# EAGLE design waterRunner (EAGLE 6.4)
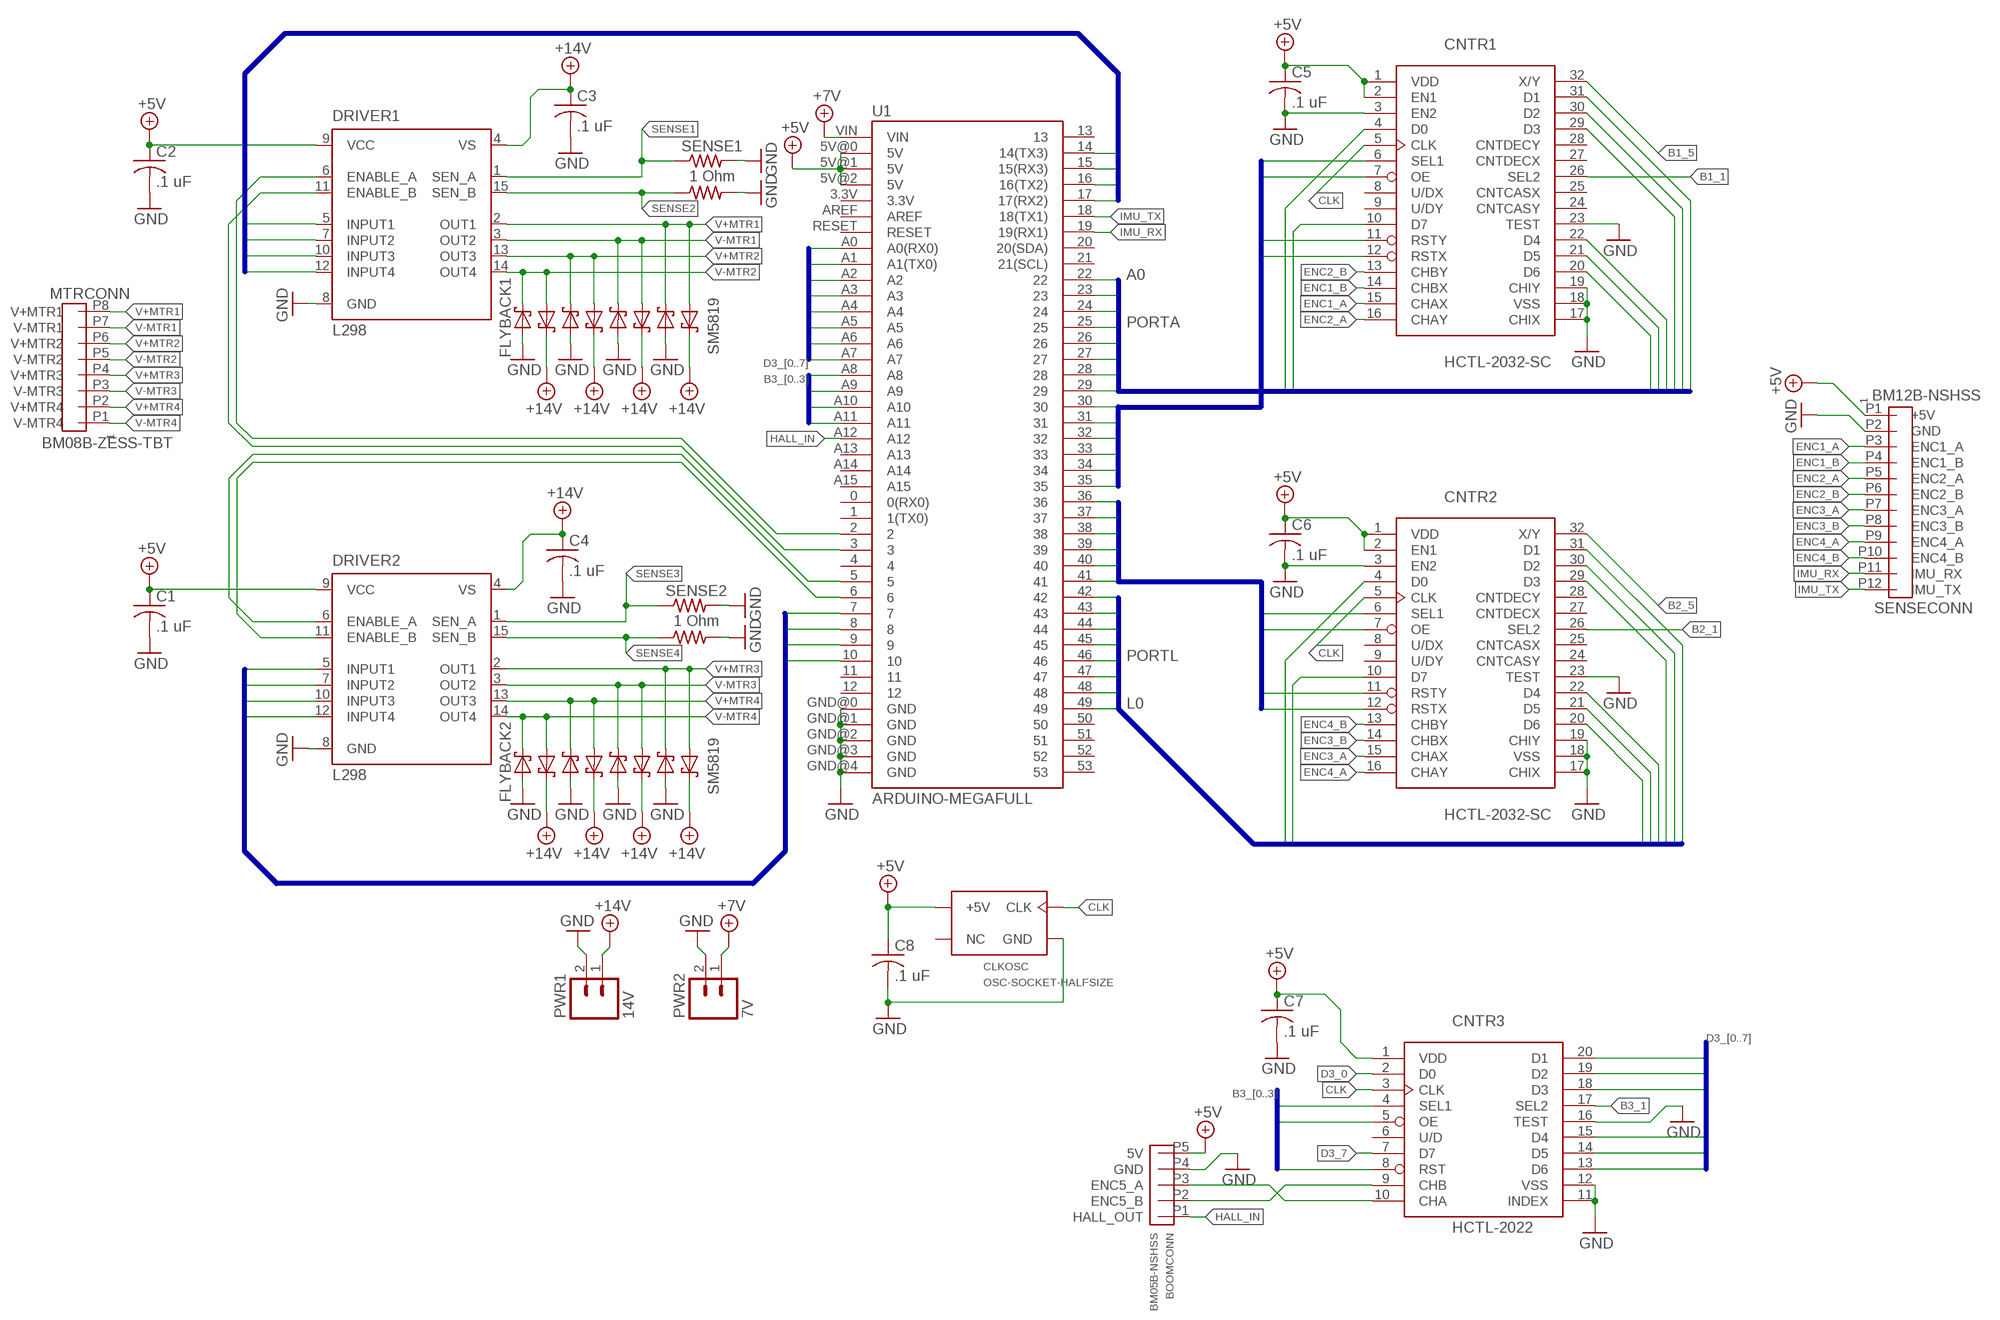
[diagram p0: schematic, sheet 1]

## Parts
BOOMCONN  BM05B-NSHSS  [BM05B-NSHSS]
C1  .1 uF  C-USC1608  [C1608]
C2  .1 uF  C-USC1608  [C1608]
C3  .1 uF  C-USC1608  [C1608]
C4  .1 uF  C-USC1608  [C1608]
C5  .1 uF  C-USC1608  [C1608]
C6  .1 uF  C-USC1608  [C1608]
C7  .1 uF  C-USC1608  [C1608]
C8  .1 uF  C-USC1608  [C1608]
CLKOSC  OSC-SOCKET-HALFSIZE  [OSC-SOCKET-HALFSIZE]
CNTR1  HCTL-2032-SC  [SO32W]
CNTR2  HCTL-2032-SC  [SO32W]
CNTR3  HCTL-2022  [DIL20]
DRIVER1  L298  [MULTIWATT-15]
DRIVER2  L298  [MULTIWATT-15]
FLYBACK1  SM5819  SM5817  [SOD123FL]
FLYBACK2  SM5819  SM5817  [SOD123FL]
MTRCONN  BM08B-ZESS-TBT  [BM08B-ZESS-TBT]
PWR1  14V  M025MM  [SCREWTERMINAL-5MM-2]
PWR2  7V  M025MM  [SCREWTERMINAL-5MM-2]
R1  1 Ohm  RL1220  [RL1220]
R2  1 Ohm  RL1220  [RL1220]
SENSE1  1 Ohm  RL1220  [RL1220]
SENSE2  1 Ohm  RL1220  [RL1220]
SENSECONN  BM12B-NSHSS  [BM12B-NSHSS]
U1  ARDUINO-MEGAFULL  [ARDUINO_MEGA]
U$1  SM5817  [SOD123FL]
U$2  SM5817  [SOD123FL]
U$3  SM5819  SM5817  [SOD123FL]
U$4  SM5817  [SOD123FL]
U$5  SM5817  [SOD123FL]
U$6  SM5817  [SOD123FL]
U$7  SM5817  [SOD123FL]
U$8  SM5819  SM5817  [SOD123FL]
U$9  SM5817  [SOD123FL]
U$10  SM5817  [SOD123FL]
U$11  SM5817  [SOD123FL]
U$12  SM5817  [SOD123FL]
U$13  SM5817  [SOD123FL]
U$14  SM5819  SM5817  [SOD123FL]

## Nets
+5V: BOOMCONN.P5(5V) C1.1 C2.1 C5.1 C6.1 C7.1 C8.1 CLKOSC.P8(+5V) CNTR1.1(VDD) CNTR1.2(EN1) CNTR2.1(VDD) CNTR2.2(EN1) CNTR3.1(VDD) DRIVER1.9(VCC) DRIVER2.9(VCC) SENSECONN.P1(+5V) U1.5V@0(5V) U1.5V@1(5V) U1.5V@2(5V)
+7V: PWR2.1 U1.VIN
+14V [PWR]: C3.1 C4.1 DRIVER1.4(VS) DRIVER2.4(VS) PWR1.1 U$1.C U$2.C U$4.C U$6.C U$8.C U$10.C U$12.C U$14.C
B1_0: CNTR1.6(SEL1) U1.30
B1_1: CNTR1.26(SEL2) U1.31
B1_2: CNTR1.7(OE) U1.32
B1_3: CNTR1.11(RSTY) U1.33
B1_4: CNTR1.12(RSTX) U1.34
B1_5: CNTR1.32(X/Y) U1.35
B2_0: CNTR2.6(SEL1) U1.36
B2_1: CNTR2.26(SEL2) U1.37
B2_2: CNTR2.7(OE) U1.38
B2_3: CNTR2.11(RSTY) U1.39
B2_4: CNTR2.12(RSTX) U1.40
B2_5: CNTR2.32(X/Y) U1.41
B3_0: CNTR3.4(SEL1) U1.A8
B3_1: CNTR3.17(SEL2) U1.A9
B3_2: CNTR3.5(OE) U1.A10
B3_3: CNTR3.8(RST) U1.A11
CLK: CLKOSC.P5(CLK) CNTR1.5(CLK) CNTR2.5(CLK) CNTR3.3(CLK)
D1_0: CNTR1.4(D0) U1.22
D1_1: CNTR1.31(D1) U1.23
D1_2: CNTR1.30(D2) U1.24
D1_3: CNTR1.29(D3) U1.25
D1_4: CNTR1.22(D4) U1.26
D1_5: CNTR1.21(D5) U1.27
D1_6: CNTR1.20(D6) U1.28
D1_7: CNTR1.10(D7) U1.29
D2_0: CNTR2.4(D0) U1.49
D2_1: CNTR2.31(D1) U1.48
D2_2: CNTR2.30(D2) U1.47
D2_3: CNTR2.29(D3) U1.46
D2_4: CNTR2.22(D4) U1.45
D2_5: CNTR2.21(D5) U1.44
D2_6: CNTR2.20(D6) U1.43
D2_7: CNTR2.10(D7) U1.42
D3_0: CNTR3.2(D0) U1.A0(A0(RX0))
D3_1: CNTR3.20(D1) U1.A1(A1(TX0))
D3_2: CNTR3.19(D2) U1.A2
D3_3: CNTR3.18(D3) U1.A3
D3_4: CNTR3.15(D4) U1.A4
D3_5: CNTR3.14(D5) U1.A5
D3_6: CNTR3.13(D6) U1.A6
D3_7: CNTR3.7(D7) U1.A7
ENC1_A: CNTR1.15(CHAX) SENSECONN.P3(ENC1_A)
ENC1_B: CNTR1.14(CHBX) SENSECONN.P4(ENC1_B)
ENC2_A: CNTR1.16(CHAY) SENSECONN.P5(ENC2_A)
ENC2_B: CNTR1.13(CHBY) SENSECONN.P6(ENC2_B)
ENC3_A: CNTR2.15(CHAX) SENSECONN.P7(ENC3_A)
ENC3_B: CNTR2.14(CHBX) SENSECONN.P8(ENC3_B)
ENC4_A: CNTR2.16(CHAY) SENSECONN.P9(ENC4_A)
ENC4_B: CNTR2.13(CHBY) SENSECONN.P10(ENC4_B)
ENC5_A: BOOMCONN.P3(ENC5_A) CNTR3.10(CHA)
ENC5_B: BOOMCONN.P2(ENC5_B) CNTR3.9(CHB)
GND: BOOMCONN.P4(GND) C1.2 C2.2 C3.2 C4.2 C5.2 C6.2 C7.2 C8.2 CLKOSC.P4(GND) CNTR1.3(EN2) CNTR1.17(CHIX) CNTR1.18(VSS) CNTR1.19(CHIY) CNTR1.23(TEST) CNTR2.3(EN2) CNTR2.17(CHIX) CNTR2.18(VSS) CNTR2.19(CHIY) CNTR2.23(TEST) CNTR3.11(INDEX) CNTR3.12(VSS) CNTR3.16(TEST) DRIVER1.8(GND) DRIVER2.8(GND) FLYBACK1.A FLYBACK2.A PWR1.2 PWR2.2 R1.P$2 R2.P$2 SENSE1.P$2 SENSE2.P$2 SENSECONN.P2(GND) U1.GND@0(GND) U1.GND@1(GND) U1.GND@2(GND) U1.GND@3(GND) U1.GND@4(GND) U$3.A U$5.A U$7.A U$9.A U$11.A U$13.A
HALL_IN: BOOMCONN.P1(HALL_OUT) U1.A12
IMU_RX: SENSECONN.P11(IMU_RX) U1.19(19(RX1))
IMU_TX: SENSECONN.P12(IMU_TX) U1.18(18(TX1))
IN1_1: DRIVER1.5(INPUT1) U1.14(14(TX3))
IN1_2: DRIVER1.7(INPUT2) U1.15(15(RX3))
IN1_3: DRIVER1.10(INPUT3) U1.16(16(TX2))
IN1_4: DRIVER1.12(INPUT4) U1.17(17(RX2))
IN2_1: DRIVER2.5(INPUT1) U1.7
IN2_2: DRIVER2.7(INPUT2) U1.8
IN2_3: DRIVER2.10(INPUT3) U1.9
IN2_4: DRIVER2.12(INPUT4) U1.10
PWM1: DRIVER1.6(ENABLE_A) U1.2
PWM2: DRIVER1.11(ENABLE_B) U1.3
PWM3: DRIVER2.6(ENABLE_A) U1.5
PWM4: DRIVER2.11(ENABLE_B) U1.6
SENSE1: DRIVER1.1(SEN_A) SENSE1.P$1
SENSE2: DRIVER1.15(SEN_B) R2.P$1
SENSE3: DRIVER2.1(SEN_A) SENSE2.P$1
SENSE4: DRIVER2.15(SEN_B) R1.P$1
V+MTR1 [PWR]: DRIVER1.2(OUT1) MTRCONN.P8(V+MTR1) U$13.C U$14.A
V+MTR2 [PWR]: DRIVER1.13(OUT3) MTRCONN.P6(V+MTR2) U$9.C U$10.A
V+MTR3 [PWR]: DRIVER2.2(OUT1) MTRCONN.P4(V+MTR3) U$7.C U$8.A
V+MTR4 [PWR]: DRIVER2.13(OUT3) MTRCONN.P2(V+MTR4) U$3.C U$4.A
V-MTR1 [PWR]: DRIVER1.3(OUT2) MTRCONN.P7(V-MTR1) U$11.C U$12.A
V-MTR2 [PWR]: DRIVER1.14(OUT4) FLYBACK1.C MTRCONN.P5(V-MTR2) U$1.A
V-MTR3 [PWR]: DRIVER2.3(OUT2) MTRCONN.P3(V-MTR3) U$5.C U$6.A
V-MTR4 [PWR]: DRIVER2.14(OUT4) FLYBACK2.C MTRCONN.P1(V-MTR4) U$2.A
Unconnected: CLKOSC.P1(NC) CNTR1.8(U/DX) CNTR1.9(U/DY) CNTR1.24(CNTCASY) CNTR1.25(CNTCASX) CNTR1.27(CNTDECX) CNTR1.28(CNTDECY) CNTR2.8(U/DX) CNTR2.9(U/DY) CNTR2.24(CNTCASY) CNTR2.25(CNTCASX) CNTR2.27(CNTDECX) CNTR2.28(CNTDECY) CNTR3.6(U/D) U1.0(0(RX0)) U1.1(1(TX0)) U1.3.3V U1.4 U1.11 U1.12 U1.13 U1.20(20(SDA)) U1.21(21(SCL)) U1.50 U1.51 U1.52 U1.53 U1.A13 U1.A14 U1.A15 U1.AREF U1.RESET

## Buses
IN1_[1..4]
IN2_[1..4]
D1_[0..7]
B1_[0..5]
D2_[0..7]
B2_[0..5]
D3_[0..7]
B3_[0..3]

## Notes on the sheet
- A0
- PORTA
- PORTL
- L0

## Library data of the parts
BOOMCONN = mylbr:BM05B-NSHSS
C1-C8 = rcl:C-US: CAPACITOR, American symbol
CLKOSC = mylbr:OSC-SOCKET-HALFSIZE
CNTR1 CNTR2 = avago2:HCTL-2032-SC
CNTR3 = avago2:HCTL-2022
DRIVER1 DRIVER2 = st-microelectronics:L298: DUAL FULL-BRIDGE DRIVER; MPN: L298N; OC_FARNELL: 1589425; OC_NEWARK: 32M1527
FLYBACK1 FLYBACK2 U$1-U$14 = diode:SM5817
MTRCONN = mylbr:BM08B-ZESS-TBT
PWR1 PWR2 = SparkFun-Connectors:M02: Header 2 Standard 2-pin 0.1" header. Use with straight break away headers (SKU : PRT-00116), right angle break away headers (PRT-00553), swiss pins (PRT-00743), machine pins (PRT-00117), and female headers (PRT-00115). Molex polarized connector foot print use with SKU : PRT-08233 with associated crimp pins and housings.
R1 R2 SENSE1 SENSE2 = mylbr:RL1220
SENSECONN = mylbr:BM12B-NSHSS
U1 = SparkFun-Boards:ARDUINO-MEGA: Arduino Mega board footprint

## Net classes
0 default: width 0.254 mm, drill 0.508 mm, clearance 0.254 mm
1 PWR: width 0.305 mm, drill 0.508 mm, clearance 0.305 mm

## Board
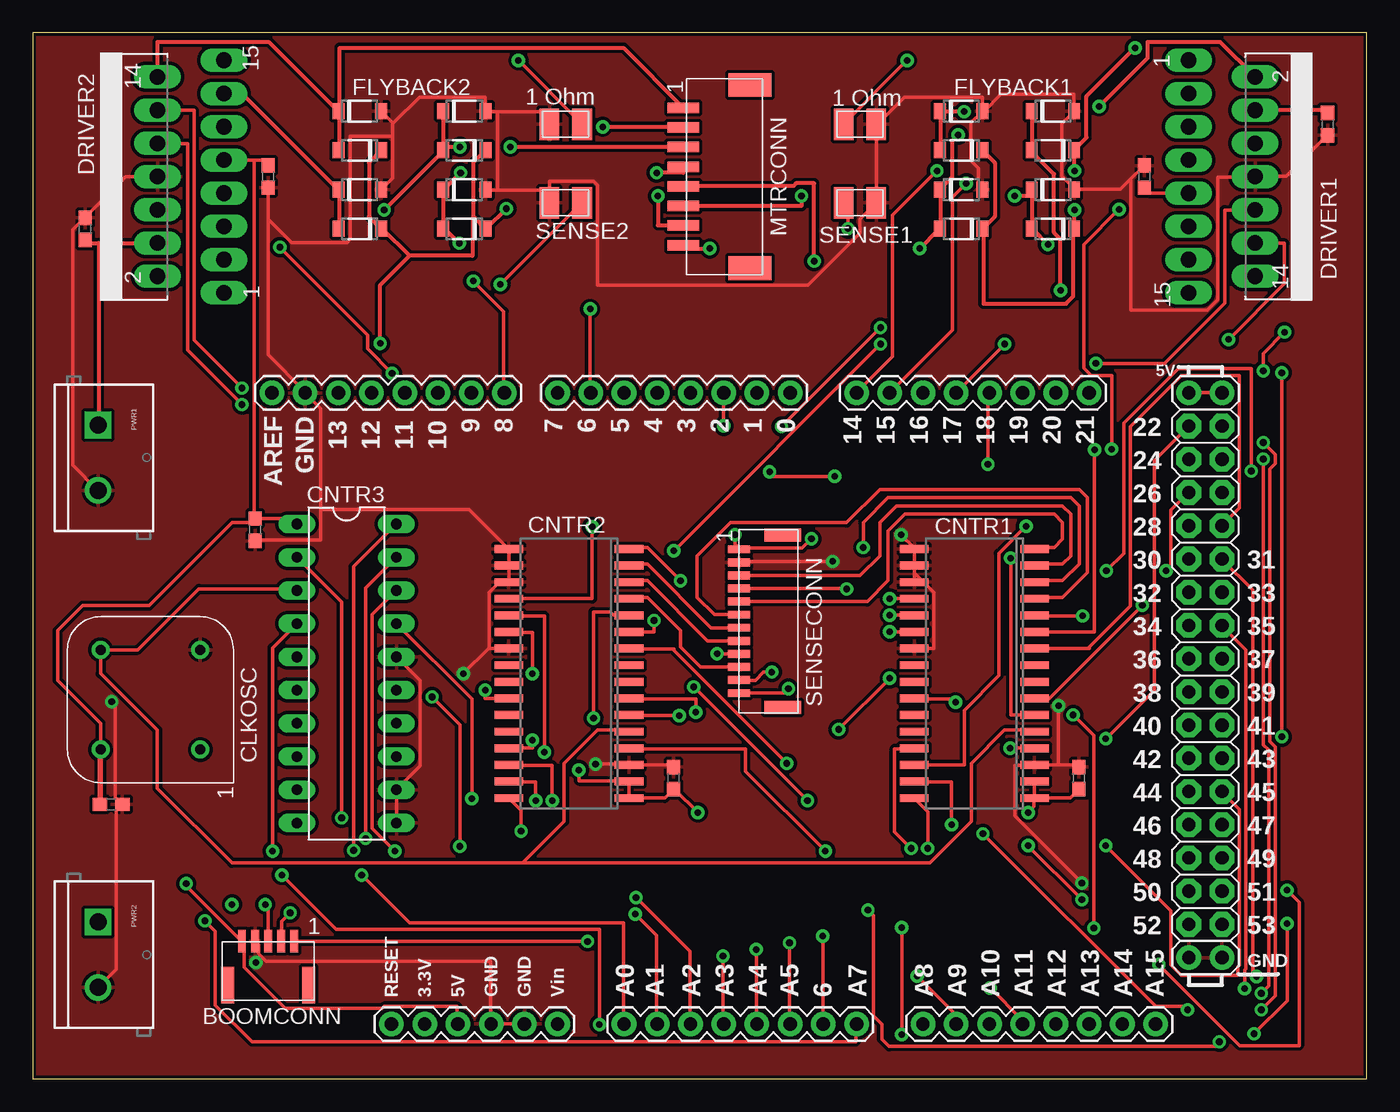
[diagram p1: board, top side]
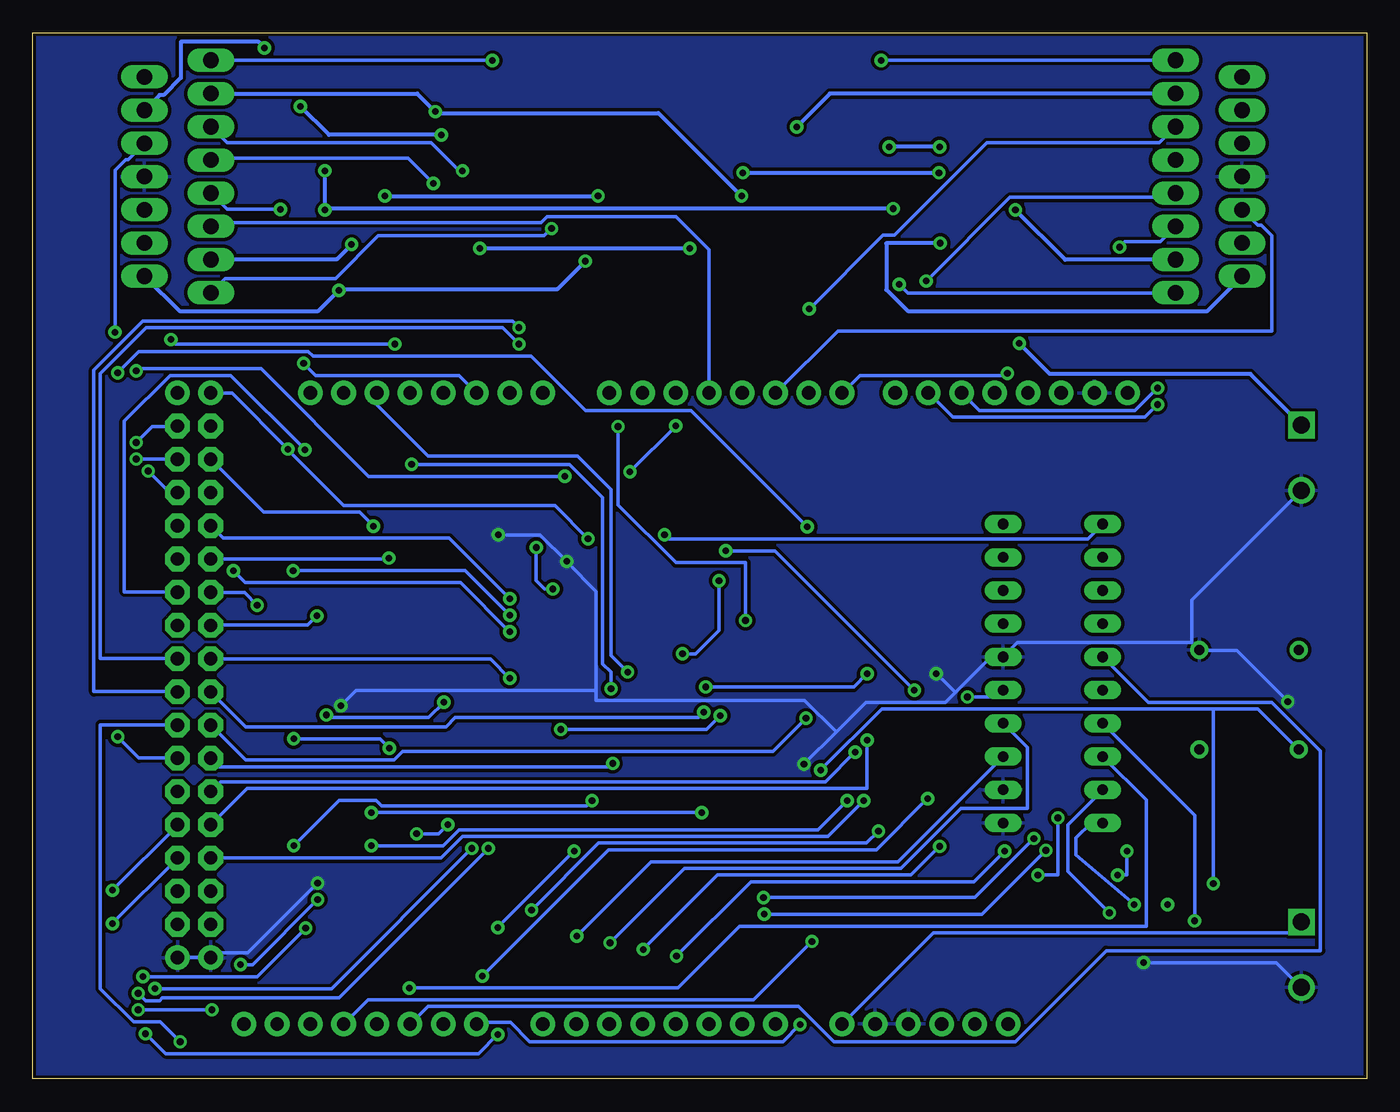
[diagram p2: board, bottom side, seen from below]

Size 102 x 80 mm. Coordinates in mm from the lower left corner, seen from the top.
Outline: 0,0 102,0 102,80 0,80 0,0
Copper layers (1*16): Top 0.035mm / dielectric 1.5mm / Bottom 0.035mm
Design rules "SparkFun": minimum track width 8mil, minimum drill 20mil, track to track 8mil, track to pad 8mil, pad to pad 8mil, via to via 8mil, smd to smd 8mil, copper to edge 10mil, drill to drill 8mil, minimum pad ring 12mil, minimum via ring 10mil, stop-mask expansion 4mil, vias tented up to drill 25mil, thermal gap 10mil

### Footprints (pad centres in the part's own frame; a part is rotated, then mirrored left to right if it is on the bottom)
BM05B-NSHSS = smd 0.6 x 1.7: P1 2,2.54; P2 1,2.54; P3 0,2.54; P4 -1,2.54; P5 -2,2.54 | smd 1 x 2.8: S1 3.1,-0.81; S2 -3.1,-0.81
C1608 = smd 1.1 x 1: 1 -0.85,0; 2 0.85,0
OSC-SOCKET-HALFSIZE = drill 0.762: P1 -3.81,-3.81; P4 3.81,-3.81; P5 3.81,3.81; P8 -3.81,3.81
SO32W = smd 0.6 x 2.2: 1 -9.525,-4.6; 2 -8.255,-4.6; 3 -6.985,-4.6; 4 -5.715,-4.6; 5 -4.445,-4.6; 6 -3.175,-4.6; 7 -1.905,-4.6; 8 -0.635,-4.6; 9 0.635,-4.6; 10 1.905,-4.6; 11 3.175,-4.6; 12 4.445,-4.6; 13 5.715,-4.6; 14 6.985,-4.6; 15 8.255,-4.6; 16 9.525,-4.6; 17 9.525,4.6; 18 8.255,4.6; 19 6.985,4.6; 20 5.715,4.6; 21 4.445,4.6; 22 3.175,4.6; 23 1.905,4.6; 24 0.635,4.6; 25 -0.635,4.6; 26 -1.905,4.6; 27 -3.175,4.6; 28 -4.445,4.6; 29 -5.715,4.6; 30 -6.985,4.6; 31 -8.255,4.6; 32 -9.525,4.6
DIL20 = drill 0.813 long: 1 -11.43,-3.81; 2 -8.89,-3.81; 3 -6.35,-3.81; 4 -3.81,-3.81; 5 -1.27,-3.81; 6 1.27,-3.81; 7 3.81,-3.81; 8 6.35,-3.81; 9 8.89,-3.81; 10 11.43,-3.81; 11 11.43,3.81; 12 8.89,3.81; 13 6.35,3.81; 14 3.81,3.81; 15 1.27,3.81; 16 -1.27,3.81; 17 -3.81,3.81; 18 -6.35,3.81; 19 -8.89,3.81; 20 -11.43,3.81
MULTIWATT-15 = drill 1.2 long: 1 -8.89,-7.62; 2 -7.62,-2.54; 3 -6.35,-7.62; 4 -5.08,-2.54; 5 -3.81,-7.62; 6 -2.54,-2.54; 7 -1.27,-7.62; 8 0,-2.54; 9 1.27,-7.62; 10 2.54,-2.54; 11 3.81,-7.62; 12 5.08,-2.54; 13 6.35,-7.62; 14 7.62,-2.54; 15 8.89,-7.62
SOD123FL = smd 0.91 x 1.22: A 1.625,0; C -1.625,0
BM08B-ZESS-TBT = smd 0.8 x 2.4: P1 5.25,1.25; P2 3.75,1.25; P3 2.25,1.25; P4 0.75,1.25; P5 -0.75,1.25; P6 -2.25,1.25; P7 -3.75,1.25; P8 -5.25,1.25 | smd 1.8 x 3.3: S1 7,-3.85; S2 -7,-3.85
SCREWTERMINAL-5MM-2 = drill 1.3 pad 2.032 square: 1 0,0 | drill 1.3 pad 2.032: 2 5,0
RL1220 = smd 1.5 x 2.4: P$1 0,0; P$2 2.5,0
BM12B-NSHSS = smd 0.6 x 1.7: P1 5.5,0; P2 4.5,0; P3 3.5,0; P4 2.5,0; P5 1.5,0; P6 0.5,0; P7 -0.5,0; P8 -1.5,0; P9 -2.5,0; P10 -3.5,0; P11 -4.5,0; P12 -5.5,0 | smd 1 x 2.8: S1 6.6,-3.35; S2 -6.6,-3.35
ARDUINO_MEGA = drill 1.016 pad 1.88: 0 63.5,50.8; 1 60.96,50.8; 2 58.42,50.8; 3 55.88,50.8; 3.3V 35.56,2.54; 4 53.34,50.8; 5 50.8,50.8; 5V@0 38.1,2.54; 5V@1 93.98,50.8; 5V@2 96.52,50.8; 6 48.26,50.8; 7 45.72,50.8; 8 41.656,50.8; 9 39.116,50.8; 10 36.576,50.8; 11 34.036,50.8; 12 31.496,50.8; 13 28.956,50.8; 14 68.58,50.8; 15 71.12,50.8; 16 73.66,50.8; 17 76.2,50.8; 18 78.74,50.8; 19 81.28,50.8; 20 83.82,50.8; 21 86.36,50.8; A0 50.8,2.54; A1 53.34,2.54; A2 55.88,2.54; A3 58.42,2.54; A4 60.96,2.54; A5 63.5,2.54; A6 66.04,2.54; A7 68.58,2.54; A8 73.66,2.54; A9 76.2,2.54; A10 78.74,2.54; A11 81.28,2.54; A12 83.82,2.54; A13 86.36,2.54; A14 88.9,2.54; A15 91.44,2.54; AREF 23.876,50.8; GND@0 40.64,2.54; GND@1 43.18,2.54; GND@2 93.98,7.62; GND@3 96.52,7.62; GND@4 26.416,50.8; RESET 33.02,2.54; VIN 45.72,2.54 | drill 1.016 pad 1.88 octagon: 22 93.98,48.26; 23 96.52,48.26; 24 93.98,45.72; 25 96.52,45.72; 26 93.98,43.18; 27 96.52,43.18; 28 93.98,40.64; 29 96.52,40.64; 30 93.98,38.1; 31 96.52,38.1; 32 93.98,35.56; 33 96.52,35.56; 34 93.98,33.02; 35 96.52,33.02; 36 93.98,30.48; 37 96.52,30.48; 38 93.98,27.94; 39 96.52,27.94; 40 93.98,25.4; 41 96.52,25.4; 42 93.98,22.86; 43 96.52,22.86; 44 93.98,20.32; 45 96.52,20.32; 46 93.98,17.78; 47 96.52,17.78; 48 93.98,15.24; 49 96.52,15.24; 50 93.98,12.7; 51 96.52,12.7; 52 93.98,10.16; 53 96.52,10.16

### Placement (x,y rotation side)
BOOMCONN  18,8 0 top
C1  85,69 90 top
C2  18,69 270 top
C3  4,65 90 top
C4  99,73 270 top
C5  80,23 90 top
C6  49,23 90 top
C7  17,42 270 top
C8  6,21 0 top
CLKOSC  9,29 90 top
CNTR1  72,31 90 top
CNTR2  41,31 90 top
CNTR3  24,31 270 top
DRIVER1  96,69 270 top
DRIVER2  7,69 90 top
FLYBACK1  78,74 0 top
FLYBACK2  25,74 0 top
MTRCONN  51,69 90 top
PWR1  5,50 270 top
PWR2  5,12 270 top
R1  42,73 180 top
R2  62,67 0 top
SENSE1  62,73 0 top
SENSE2  42,67 180 top
SENSECONN  54,35 90 top
U1  -5.59,1.66 0 top
U$1  78,71 180 top
U$2  25,71 180 top
U$3  25,68 0 top
U$4  25,65 180 top
U$5  33,74 0 top
U$6  33,71 180 top
U$7  33,68 0 top
U$8  33,65 180 top
U$9  78,68 0 top
U$10  78,65 180 top
U$11  71,74 0 top
U$12  71,71 180 top
U$13  71,68 0 top
U$14  71,65 180 top

### Tracks (layer width: path | path; a pad name or v marks a point on that pad's centre or on a via)
+5V  (via drill 0.51)
  Top 0.254: C5.1 79.33,21.48 CNTR1.1 | CNTR1.1 CNTR1.2 | CNTR3.1 19.77,42.85 C7.1 | C1.1 85.42,67.73 DRIVER1.9 | C2.1 17.58,70.27 16.92,70.27 | 16.92,70.27 DRIVER2.9 | CLKOSC.P8 5.19,27.2 1.91,30.48 1.91,34.29 3.81,36.2 8.89,36.2 15.24,42.55 16.7,42.55 C7.1 | U1.5V@1 88.39,52.48 90.88,52.48 U1.5V@2 | v83.06,66.5 80.37,63.8 80.37,54.36 80.92,53.8 82.5,53.8 v82.5,48.16 | U1.5V@0 32.46,4.22 32.46,5.54 26.87,5.54 26.72,5.38 19.3,5.38 16.15,8.53 16.15,10.36 16,10.52 BOOMCONN.P5 15.9,10.62 11.73,14.78 v11.73,14.94 | v50.85,20.37 49.12,22.1 C6.1 48.33,21.48 CNTR2.1 CNTR2.2 45.52,22.81 41.76,22.81 v41.76,23.62 | v76.1,20.37 76.56,20.83 76.56,21.39 CNTR1.1 | 54,40.54 SENSECONN.P1 | v53.7,41.6 53.7,40.89 53.95,40.64 SENSECONN.P1 | 16.92,70.27 16.92,42.93 C7.1 | v59.54,41.3 58.83,40.59 54.1,40.59 SENSECONN.P1
  Top 0.406: CLKOSC.P8 5.15,25.19 C8.1
  Bottom 0.254: v83.06,66.5 87.12,66.5 88.34,67.72 DRIVER1.9 | U1.5V@1 88.34,52.43 86.77,52.43 v82.5,48.16 82.45,48.06 78.23,43.84 62.08,43.84 v59.54,41.3 | v76.1,20.37 v50.85,20.37 | v53.7,41.6 53.39,41.3 21.34,41.3 20.22,42.42 CNTR3.1 | v41.76,23.62 37.08,28.3 11.73,28.3 | 11.73,28.3 8.33,28.3 5.23,25.2 CLKOSC.P8 | 11.73,28.3 v11.73,14.94
+7V
  Bottom 0.254: U1.VIN 40.08,4.22 33.12,11.18 5.84,11.18 5.03,11.99 PWR2.1
+14V  (via drill 0.51)
  Top 0.305: C4.1 98.77,74.08 DRIVER1.4 | C3.1 4.23,63.92 5.03,63.92 | 5.03,63.92 DRIVER2.4 | U$12.C 72.64,70.97 73.56,70.05 73.56,65.94 72.64,65.02 U$14.C 72.69,64.87 72.69,59.28 78.99,59.28 79.55,59.84 79.55,64.92 79.6,64.97 U$10.C 79.65,65.13 v79.65,66.45 | v79.65,69.44 79.65,70.97 U$1.C 79.7,71.12 80.57,71.98 80.57,75.13 v84.28,78.84 | U$2.C 26.62,70.97 25.7,70.05 25.7,65.94 26.62,65.02 U$4.C 26.77,64.97 28.8,62.94 | 33.73,65.89 33.68,65.94 33.68,70.05 34.59,70.97 U$6.C | 33.73,65.89 34.59,65.02 U$8.C 34.75,65.08 v36.22,66.55 | 28.8,62.94 33.63,62.94 33.63,65.79 33.73,65.89 | 5.03,63.92 5.03,50.04 PWR1.1 | 28.8,62.94 26.57,60.71 v26.57,56.24
  Bottom 0.305: v79.65,69.44 v79.65,66.45 79.55,66.55 v36.22,66.55 | v84.28,78.84 84.73,79.3 90.68,79.3 90.68,76.56 92,75.23 92.3,75.23 93.42,74.12 DRIVER1.4 | v26.57,56.24 24.23,53.9 8.89,53.9 5.03,50.04 PWR1.1
B1_0  (via drill 0.51)
  Top 0.254: v74.78,39.83 74.78,27.84 76.56,27.84 CNTR1.6
  Bottom 0.254: v74.78,39.83 74.83,39.78 88.34,39.78 U1.30
B1_1  (via drill 0.51)
  Top 0.254: v70.56,28.8 70.56,29.06 67.41,29.06 CNTR1.26 | v79.55,27.84 81.13,26.26 v81.13,11.53 | v93.57,7.82 93.27,8.13 93.27,37.39 90.93,39.73 U1.31
  Bottom 0.254: v70.56,28.8 71.73,27.64 79.35,27.64 v79.55,27.84 | v81.13,11.53 84.84,7.82 v93.57,7.82
B1_2  (via drill 0.51)
  Top 0.254: v84.84,36.22 77.72,29.11 76.61,29.11 CNTR1.7
  Bottom 0.254: v84.84,36.22 85.8,37.19 88.34,37.19 U1.32
B1_3  (via drill 0.51)
  Top 0.254: v81.18,48.11 81.18,34.19 76.61,34.19 CNTR1.11
  Bottom 0.254: v81.18,48.11 86.87,53.8 91.49,53.8 95,50.29 95,37.24 90.93,37.24 U1.33
B1_4  (via drill 0.51)
  Top 0.254: v80.26,35.41 76.61,35.41 CNTR1.12
  Bottom 0.254: v80.26,35.41 80.97,34.7 88.34,34.7 U1.34
B1_5  (via drill 0.51)
  Top 0.254: v68.43,17.63 68.43,20.42 67.41,21.44 CNTR1.32 | v92.66,6.91 92.66,8.33 92.76,8.43 92.76,32.82 90.93,34.65 U1.35
  Bottom 0.254: v68.43,17.63 79.15,6.91 v92.66,6.91
B2_0  (via drill 0.51)
  Top 0.254: v49.43,27.79 45.62,27.79 CNTR2.6 | v65.53,30.63 v61.62,26.72
  Bottom 0.254: v49.43,27.79 50.49,26.72 v61.62,26.72 | v65.53,30.63 67,32.11 88.34,32.11 U1.36
B2_1  (via drill 0.51)
  Top 0.254: v34.59,29.72 34.59,29.11 36.37,29.11 CNTR2.26 | v64.82,56.19 v49.02,40.39
  Bottom 0.254: v34.59,29.72 45.26,40.39 v49.02,40.39 | v64.82,56.19 66.09,57.45 93.32,57.45 96.83,53.95 96.83,32.16 90.93,32.16 U1.37
B2_2  (via drill 0.51)
  Top 0.254: v50.7,28.04 50.7,29.06 45.62,29.06 CNTR2.7
  Bottom 0.254: v50.7,28.04 51.1,27.64 69.7,27.64 70.41,26.92 85.7,26.92 88.34,29.57 U1.38
B2_3  (via drill 0.51)
  Top 0.254: v47.5,35.05 47.5,34.19 45.62,34.19 CNTR2.11 | v64.82,57.45 v57.25,49.89
  Bottom 0.254: v47.5,35.05 47.5,39.47 52.83,39.47 57.25,43.89 v57.25,49.89 | v64.82,57.45 65.33,57.96 93.57,57.96 97.33,54.2 97.33,29.62 90.93,29.62 U1.39
B2_4  (via drill 0.51)
  Top 0.254: v42.88,27.58 42.88,35.71 44.15,35.71 44.4,35.46 45.57,35.46 CNTR2.12
  Bottom 0.254: v42.88,27.58 45.41,25.04 73.71,25.04 74.37,24.38 85.7,24.38 88.34,27.03 U1.40
B2_5  (via drill 0.51)
  Top 0.254: v37.34,18.95 37.34,20.52 36.42,21.44 CNTR2.32 | v63.86,12.9 64.26,12.5 64.26,4.83 64.92,4.17 64.92,3.05 65.48,2.49 90.73,2.49 v90.73,2.85
  Bottom 0.254: v37.34,18.95 38.25,18.03 58.73,18.03 v63.86,12.9 | v90.73,2.85 92.25,4.37 94.28,4.37 96.83,6.91 96.83,27.08 90.93,27.08 U1.41
B3_0  (via drill 0.51)
  Top 0.254: v18.34,17.42 18.34,32.97 20.17,34.8 CNTR3.4 | v19.05,15.6 23.22,11.43 43.33,11.43 v43.33,4.17
  Bottom 0.254: v18.34,17.42 18.34,15.6 v19.05,15.6 | v43.33,4.17 44.65,2.85 64.01,2.85 65.48,4.32 67.92,4.32 68.02,4.22 U1.A8
B3_1  (via drill 0.51)
  Top 0.254: v33.58,21.44 33.58,29.06 27.84,34.8 CNTR3.17 | v67.61,7.87 70.56,4.93 70.56,4.22 U1.A9
  Bottom 0.254: v33.58,21.44 37.49,17.53 57.96,17.53 v67.61,7.87
B3_2
  Bottom 0.254: CNTR3.5 20.17,32.26 16.71,28.8 7.26,28.8 3.56,25.09 3.56,9.8 19.91,9.8 26.87,2.85 40.74,2.85 43.43,5.54 71.78,5.54 73.1,4.22 U1.A10
B3_3  (via drill 0.51)
  Top 0.254: v73.2,6.96 75.64,4.52 75.64,4.22 U1.A11
  Bottom 0.254: v73.2,6.96 52.68,6.96 47.95,11.68 16.87,11.68 16.87,21.34 20.17,24.64 CNTR3.8
CLK
  Top 0.254: CNTR2.5 45.48,26.67 43.18,26.67 40.64,24.13 40.64,19.68 37.47,16.51 | 37.47,16.51 15.24,16.51 9.53,22.23 9.53,26.67 5.19,31 CLKOSC.P5 8.04,32.81 12.7,37.47 20.07,37.47 CNTR3.3 | CNTR1.5 76.48,26.67 74.3,26.67 71.75,24.13 71.75,19.68 68.58,16.51 37.47,16.51
D1_0  (via drill 0.51)
  Top 0.254: v74.73,25.3 76.56,25.3 CNTR1.4 | v82.04,26.01 85.75,29.72 85.75,47.3 88.34,49.89 U1.22
  Bottom 0.254: v74.73,25.3 75.44,26.01 v82.04,26.01
D1_1  (via drill 0.51)
  Top 0.254: v70.26,19.46 70.26,22.71 67.41,22.71 CNTR1.31 | v72.64,18.75 85.85,5.54 88.29,5.54 v88.29,5.28 | v93.93,5.28 95,6.35 95,25.4 94.59,25.81 94.59,46.63 95,47.04 95,47.75 v94.08,48.67
  Bottom 0.254: v70.26,19.46 70.97,18.75 v72.64,18.75 | v93.93,5.28 v88.29,5.28 | v94.08,48.67 92.86,49.89 90.93,49.89 U1.23
D1_2  (via drill 0.51)
  Top 0.254: v75.95,42.27 73.86,40.18 73.86,30.84 71.22,28.19 71.22,24.03 67.41,24.03 CNTR1.30
  Bottom 0.254: v75.95,42.27 77.01,43.33 84.33,43.33 88.34,47.35 U1.24
D1_3  (via drill 0.51)
  Top 0.254: v67.16,17.63 65.89,18.9 65.89,25.25 67.36,25.25 CNTR1.29 | v93.93,6.55 94.49,7.11 94.49,25.15 94.08,25.55 v94.08,47.4
  Bottom 0.254: v67.16,17.63 78.59,6.2 92.1,6.2 92.3,5.99 93.37,5.99 v93.93,6.55 | v94.08,47.4 90.93,47.4 U1.25
D1_4  (via drill 0.51)
  Top 0.254: v65.53,34.19 67.36,34.19 CNTR1.22 | v86.67,38.86 87.02,39.22 87.02,43.48 88.34,44.81 U1.26
  Bottom 0.254: v65.53,34.19 69.29,37.95 85.75,37.95 v86.67,38.86
D1_5  (via drill 0.51)
  Top 0.254: v65.53,35.46 67.36,35.46 CNTR1.21 | v82.09,38.86 83.41,40.18 83.41,50.14 87.58,54.3 93.17,54.3 v93.17,46.48
  Bottom 0.254: v65.53,35.46 68.94,38.86 v82.09,38.86 | v93.17,46.48 91.54,44.86 90.93,44.86 U1.27
D1_6  (via drill 0.51)
  Top 0.254: v65.53,36.73 67.36,36.73 CNTR1.20
  Bottom 0.254: v65.53,36.73 70.16,41.35 87.43,41.35 88.34,42.27 U1.28
D1_7
  Top 0.254: CNTR1.10 80.77,32.92 80.77,33.02 83.92,36.17 83.92,49.89 87.83,53.8 92.25,53.8 92.25,43.64 90.93,42.32 U1.29
D2_0  (via drill 0.51)
  Top 0.254: v60.6,17.42 54.51,23.52 54.51,25.25 45.62,25.25 CNTR2.4 | v66.45,3.4 v66.45,11.58 | v93.37,3.45 95.91,5.99 v95.91,11.89
  Bottom 0.254: v66.45,11.58 v60.6,17.42 | v66.45,3.4 67.92,1.93 91.85,1.93 v93.37,3.45 | v95.91,11.89 90.93,16.87 U1.49
D2_1  (via drill 0.51)
  Top 0.254: v38.46,21.29 38.46,22.71 36.42,22.71 CNTR2.31
  Bottom 0.254: v38.46,21.29 41.2,18.54 69.14,18.54 70.76,16.92 88.34,16.92 U1.48
D2_2  (via drill 0.51)
  Top 0.254: v39.73,21.29 39.73,23.98 36.42,23.98 CNTR2.30 | v80.21,13.72 v76.1,17.83 | v86.11,8.74 92.3,2.54 96.83,2.54 96.83,13.51 v95.91,14.43
  Bottom 0.254: v39.73,21.29 41.96,19.05 69.39,19.05 70.61,17.83 v76.1,17.83 | v80.21,13.72 85.19,8.74 v86.11,8.74 | v95.91,14.43 90.93,19.41 U1.47
D2_3  (via drill 0.51)
  Top 0.254: v38.2,25.91 38.2,25.3 36.42,25.3 CNTR2.29
  Bottom 0.254: v38.2,25.91 38.2,22.2 85.6,22.2 88.34,19.46 U1.46
D2_4  (via drill 0.51)
  Top 0.254: v38.2,30.99 38.2,34.14 36.42,34.14 CNTR2.22 | v59.23,21.29 v50.55,29.97 | v82.04,17.83 87.02,12.85 87.02,8.74 87.83,7.92 92.15,7.92 92.15,8.59 92.25,8.69 92.25,20.62 90.93,21.95 U1.45
  Bottom 0.254: v38.2,30.99 39.22,29.97 v50.55,29.97 | v59.23,21.29 59.64,20.88 75.34,20.88 75.74,21.29 78.59,21.29 v82.04,17.83
D2_5  (via drill 0.51)
  Top 0.254: v39.12,24.99 39.12,35.41 36.42,35.41 CNTR2.21
  Bottom 0.254: v39.12,24.99 41.4,22.71 87.63,22.71 88.34,22 U1.44
D2_6  (via drill 0.51)
  Top 0.254: v42.77,42.22 42.77,36.73 36.42,36.73 CNTR2.20 | v95.5,26.16 v95.5,54
  Bottom 0.254: v42.77,42.22 51.66,51.1 59.74,51.1 63.91,55.27 80.57,55.27 80.92,55.63 93.88,55.63 v95.5,54 | v95.5,26.16 93.88,24.54 90.93,24.54 U1.43
D2_7  (via drill 0.51)
  Top 0.254: v57.66,24.13 49.02,32.77 49.02,32.87 45.62,32.87 CNTR2.10
  Bottom 0.254: v57.66,24.13 57.91,23.88 87.73,23.88 88.34,24.49 U1.42
D3_0  (via drill 0.51)
  Top 0.254: v23.62,19.96 23.62,36.47 20.22,39.88 CNTR3.2 | v25.15,15.6 28.8,11.94 45.16,11.94 45.16,4.22 U1.A0
  Bottom 0.254: v23.62,19.96 23.62,15.6 v25.15,15.6
D3_1  (via drill 0.51)
  Top 0.254: v24.54,17.48 24.54,39.17 27.79,42.42 CNTR3.20 | v46.08,12.6 47.7,10.97 47.7,4.22 U1.A1
  Bottom 0.254: v24.54,17.48 29.41,12.6 v46.08,12.6
D3_2  (via drill 0.51)
  Top 0.254: v25.45,18.39 25.45,37.54 27.79,39.88 CNTR3.19 | v46.13,13.87 50.24,9.75 50.24,4.22 U1.A2
  Bottom 0.254: v25.45,18.39 29.97,13.87 v46.13,13.87
D3_3  (via drill 0.51)
  Top 0.254: v27.69,17.42 25.96,19.15 25.96,35.51 27.79,37.34 CNTR3.18 | v52.78,9.4 52.78,4.22 U1.A3
  Bottom 0.254: v27.69,17.42 30.02,15.09 47.09,15.09 v52.78,9.4
D3_4  (via drill 0.51)
  Top 0.254: v30.53,29.21 32.66,27.08 v32.66,17.78 | v55.32,9.91 55.32,4.22 U1.A4
  Bottom 0.254: v30.53,29.21 28.35,29.21 27.84,29.72 CNTR3.15 | v32.66,17.78 34.85,15.6 49.63,15.6 v55.32,9.91
D3_5  (via drill 0.51)
  Top 0.254: v57.86,10.41 57.86,4.22 U1.A5
  Bottom 0.254: v57.86,10.41 52.17,16.1 35.61,16.1 31.04,20.68 25.96,20.68 25.96,25.35 27.79,27.18 CNTR3.14
D3_6  (via drill 0.51)
  Top 0.254: v60.4,10.92 60.4,4.22 U1.A6
  Bottom 0.254: v60.4,10.92 54.71,16.61 35.87,16.61 27.84,24.64 CNTR3.13
D3_7  (via drill 0.51)
  Top 0.254: v13.16,12.09 13.97,11.28 13.97,5.64 16.76,2.85 62.94,2.85 62.94,4.17 U1.A7
  Bottom 0.254: v13.16,12.09 13.16,20.17 20.17,27.18 CNTR3.7
ENC1_A
  Top 0.254: CNTR1.15 76.72,39.37 78.74,39.37 79.38,40.01 79.38,43.18 78.74,43.81 66.04,43.81 64.77,42.55 64.77,40.01 63.27,38.5 SENSECONN.P3
ENC1_B  (via drill 0.51)
  Top 0.254: CNTR1.14 76.72,38.1 78.74,38.1 80.01,39.37 80.01,43.81 79.38,44.45 65.41,44.45 63.5,42.55 v63.5,40.64 | v62.23,37.47 62.2,37.5 SENSECONN.P4
  Bottom 0.254: v63.5,40.64 63.5,38.1 62.87,37.47 v62.23,37.47
ENC2_A
  Top 0.254: CNTR1.16 76.48,40.64 | 76.48,40.64 76.2,40.64 | 76.48,40.64 78.11,40.64 78.74,41.27 78.74,42.55 78.11,43.18 66.67,43.18 65.41,41.91 65.41,38.1 63.8,36.5 SENSECONN.P5
ENC2_B
  Top 0.254: CNTR1.13 76.72,36.83 78.74,36.83 80.64,38.73 80.64,44.45 80.01,45.09 64.77,45.09 62.23,42.55 53.34,42.55 50.8,40.01 50.8,36.83 52.13,35.5 SENSECONN.P6
ENC3_A
  Top 0.254: CNTR2.15 45.72,39.37 46.99,39.37 51.86,34.5 SENSECONN.P7
ENC3_B
  Top 0.254: CNTR2.14 45.72,38.1 46.99,38.1 51.59,33.5 SENSECONN.P8
ENC4_A  (via drill 0.51)
  Top 0.254: CNTR2.16 45.72,40.64 46.99,40.64 v49.53,38.1 | v52.32,32.51 52.34,32.5 SENSECONN.P9
  Bottom 0.254: v49.53,38.1 49.53,34.29 51.31,32.51 v52.32,32.51
ENC4_B
  Top 0.254: CNTR2.13 45.72,36.83 46.99,36.83 49.53,34.29 49.53,33.02 51.05,31.5 SENSECONN.P10
ENC5_A  (via drill 0.51)
  Top 0.254: BOOMCONN.P3 18,13.12 v17.78,13.34
  Bottom 0.254: v17.78,13.34 22.23,17.14 22.23,18.41 21.07,19.57 CNTR3.10
ENC5_B  (via drill 0.51)
  Top 0.254: BOOMCONN.P2 19,10.74 19.05,12.06 v19.68,12.7
  Bottom 0.254: v19.68,12.7 22.86,15.88 22.86,19.44 CNTR3.9
GND  (via drill 0.51)
  Top 0.254: C5.2 79.83,24.02 78.44,24.02 | 78.44,24.02 CNTR1.3 76.5,23.98 75.08,23.98 75.08,20.12 v80.21,14.99 | C6.2 48.84,24.02 CNTR2.3 45.52,24.08 v43.03,24.08 | 67.4,38.56 CNTR1.18 CNTR1.17 67.36,40.64 v66.4,41.6 | 67.4,38.56 CNTR1.19 | C4.2 98.96,72.14 95.86,69.04 93.47,69.04 DRIVER1.8 93.37,68.94 90.63,68.94 90.63,59.59 89.81,58.78 83.97,58.78 83.97,68.68 83.9,68.76 | U$13.A 72.59,68.02 72.29,68.33 72.29,69.65 71.73,70.21 71.73,73.1 72.59,73.97 U$11.A | 83.9,68.76 83.16,68.02 79.65,68.02 U$9.A 79.6,68.12 78.69,69.04 78.69,73.05 79.6,73.97 FLYBACK1.A 79.6,74.12 79.6,75.29 74.02,75.29 72.75,74.02 U$11.A | 83.9,68.76 84.99,69.85 C1.2 | U$11.A 72.59,74.12 72.59,75.08 66.65,75.08 64.62,73.05 SENSE1.P$2 64.52,73 64.52,67 R2.P$2 64.41,66.9 63.25,65.73 63.25,64.67 59.28,60.71 43.18,60.71 43.18,68.33 42.88,68.63 39.52,68.63 39.52,68.07 SENSE2.P$2 39.47,67 39.47,67.97 35.56,67.97 | 35.56,67.97 34.65,67.97 U$7.A | 27.53,73.1 27.53,72.08 | 27.53,72.08 27.53,68.89 26.67,68.02 U$3.A | 27.53,73.1 26.67,73.97 FLYBACK2.A | 35.56,73.97 39.47,73.97 39.47,73.05 R1.P$2 | 35.56,73.97 34.65,73.97 U$5.A 34.59,74.12 34.59,75.08 29.57,75.08 27.64,73.15 27.53,73.1 | 35.56,73.97 35.56,67.97 | 34.9,32.92 36.37,32.92 CNTR2.23 | 34.9,32.92 34.9,37.19 35.66,37.95 36.37,37.95 CNTR2.19 36.42,38.1 36.42,39.22 CNTR2.18 36.42,39.37 36.42,40.49 CNTR2.17 36.32,40.59 33.38,43.54 22,43.54 | 22,43.54 22,51.26 20.83,52.43 U1.GND@4 20.78,52.58 17.98,55.37 17.98,65.68 | 22,43.54 22,41.2 17.02,41.2 C7.2 | 17.98,65.68 17.98,68.12 C2.2 | 27.53,72.08 24.28,72.08 24.28,64.21 24.03,63.96 19.81,63.96 18.09,65.68 17.98,65.68
  Top 0.254: PWR2.2 5.03,7.01 6.4,8.38 6.4,20.57 6.81,20.98 C8.2 6.76,21.08 6.3,21.54 6.3,28.6 v6.04,28.85 | 17.5,9.32 17.83,8.99 35,8.99 35,4.22 U1.GND@0 35.15,4.22 37.54,4.22 U1.GND@1 | 17.5,9.32 17.27,9.55 17.27,10.26 17.02,10.52 BOOMCONN.P4 | 17.5,9.32 v17.07,8.89 | 54,39.52 SENSECONN.P2 54.1,39.57 v61.16,39.57 | CNTR1.23 67.41,32.92 68.89,32.92 68.89,37.19 67.51,38.56 67.4,38.56 | 9.55,69.04 DRIVER2.8 9.5,68.99 7.11,68.99 4.01,65.89 C3.2 3.91,65.79 3.05,64.92 3.05,46.94 4.98,45.01 PWR1.2 | CNTR3.11 27.84,19.61 27.84,22.1 CNTR3.12 27.89,22.2 29.62,23.93 29.62,30.48 27.84,32.26 CNTR3.16 | v78.44,28.55 78.44,24.02 | v32.92,30.99 34.8,32.87 34.9,32.92
  Bottom 0.254: v17.07,8.89 6.91,8.89 5.03,7.01 PWR2.2 | v80.21,14.99 85.55,9.65 87.99,9.65 88.34,9.3 U1.GND@2 88.49,9.3 90.88,9.3 U1.GND@3 | v66.4,41.6 63.2,41.6 v61.16,39.57 61.11,39.47 58.93,37.29 58.93,29.72 | 13.41,33.38 12.85,32.82 CLKOSC.P4 12.7,32.77 9.96,32.77 v6.04,28.85 | 13.41,33.38 26.72,33.38 27.79,32.31 CNTR3.16 27.89,32.21 28.8,32.21 31.47,29.54 | 40.56,26.54 38.3,28.8 32.21,28.8 31.47,29.54 | 40.56,26.54 v43.03,24.08 | PWR1.2 5.03,44.96 13.36,36.63 13.36,33.48 13.41,33.38 | 58.93,29.72 58.93,28.96 42.98,28.96 40.56,26.54 | v78.44,28.55 77.27,29.72 58.93,29.72 | 31.47,29.54 v32.92,30.99
  pour Bottom: -1.27,81.28 103.5,81.28 103.5,-1.91 -1.27,-1.91
  pour Top: -0.64,80.64 102.23,80.64 102.87,-0.64 -0.64,-0.64
HALL_IN  (via drill 0.51)
  Top 0.254: v42.42,10.52 20.02,10.52 BOOMCONN.P1
  Bottom 0.254: v42.42,10.52 46.89,6.04 76.35,6.04 78.18,4.22 U1.A12
IMU_RX  (via drill 0.51)
  Top 0.254: SENSECONN.P11 54.02,30.48 55.24,30.48 55.88,31.11 v56.52,31.11
  Bottom 0.254: v56.52,31.11 57.78,32.38 57.78,45.09 60.33,47.62 71.75,47.62 75.69,51.56 U1.19
IMU_TX  (via drill 0.51)
  Top 0.254: SENSECONN.P12 57.44,29.5 v57.78,29.84 | v73.03,46.99 73.03,51.95 U1.18
  Bottom 0.254: v57.78,29.84 57.78,31.11 58.42,31.75 58.42,44.45 60.96,46.99 v73.03,46.99
IN1_1  (via drill 0.51)
  Top 0.254: v69.14,69.44 65.73,66.04 65.73,55.22 62.99,52.48 U1.14
  Bottom 0.254: v69.14,69.44 69.39,69.44 71.53,71.58 87.12,71.58 88.34,72.8 DRIVER1.5
IN1_2  (via drill 0.51)
  Top 0.254: v71.37,68.48 70.31,67.41 70.31,57.25 65.53,52.48 U1.15
  Bottom 0.254: v71.37,68.48 73.3,70.41 88.24,70.41 88.34,70.31 DRIVER1.7
IN1_3  (via drill 0.51)
  Top 0.254: v81.28,54.71 86.51,54.71 91.14,59.33 91.14,66.45 93.42,66.45 DRIVER1.10
  Bottom 0.254: v81.28,54.71 80.37,53.8 69.39,53.8 68.07,52.48 U1.16
IN1_4  (via drill 0.51)
  Top 0.254: v91.44,56.54 95.71,60.81 95.71,63.91 93.47,63.91 DRIVER1.12 | v74.32,56.19 70.61,52.48 U1.17
  Bottom 0.254: v91.44,56.54 91.08,56.19 v74.32,56.19
IN2_1  (via drill 0.51)
  Top 0.254: v18.9,63.6 25.6,56.9 25.6,55.83 v27.48,53.95
  Bottom 0.254: v18.9,63.6 18.49,64.01 15.8,64.01 14.63,65.18 DRIVER2.5 | v27.48,53.95 27.64,53.8 38.76,53.8 40.08,52.48 U1.7
IN2_2  (via drill 0.51)
  Top 0.254: v33.68,61.01 36.02,58.67 36.02,52.48 U1.8
  Bottom 0.254: v33.68,61.01 27.28,67.41 14.94,67.41 14.63,67.72 DRIVER2.7
IN2_3  (via drill 0.51)
  Top 0.254: v16,51.56 11.84,55.73 11.84,71.53 9.55,71.53 DRIVER2.10
  Bottom 0.254: v16,51.56 16.97,50.6 31.65,50.6 33.48,52.43 U1.9
IN2_4  (via drill 0.51)
  Top 0.254: v16,52.83 12.34,56.49 12.34,74.07 9.55,74.07 DRIVER2.12
  Bottom 0.254: v16,52.83 17.73,51.1 29.62,51.1 30.94,52.43 U1.10
N$3  (via drill 0.51)
  other vias: 15.24,13.34
PWM1  (via drill 0.51)
  Top 0.254: v95.71,57.1 94.08,55.47 v94.08,54.15 | v61.32,46.08 56.34,46.08 v56.34,46.43 | v52.83,49.94 52.83,52.43 U1.2
  Bottom 0.254: v95.71,57.1 95.71,69.49 94.89,70.31 94.69,70.31 93.47,71.53 DRIVER1.6 | v94.08,54.15 93.93,54.3 84.53,54.3 76.3,46.08 v61.32,46.08 | v52.83,49.94 v56.34,46.43
PWM2
  Bottom 0.254: DRIVER1.11 88.34,65.23 88.09,65.48 63.14,65.48 62.69,65.94 52.83,65.94 50.29,63.4 50.29,52.48 U1.3
PWM3
  Bottom 0.254: DRIVER2.6 9.5,66.45 8.33,65.28 8.08,65.28 7.26,64.47 7.26,57.2 40.44,57.2 45.16,52.48 U1.5
PWM4  (via drill 0.51)
  Top 0.254: v42.62,58.88 42.62,52.48 U1.6
  Bottom 0.254: v42.62,58.88 36.98,64.52 36.12,64.52 29.06,71.58 15.85,71.58 14.63,72.8 DRIVER2.11
SENSE1  (via drill 0.51)
  Top 0.254: v66.85,77.88 62.03,73.05 SENSE1.P$1
  Bottom 0.254: v66.85,77.88 88.34,77.88 DRIVER1.1
SENSE2  (via drill 0.51)
  Top 0.254: v62.33,65.02 62.33,66.65 62.03,66.95 R2.P$1
  Bottom 0.254: v62.33,65.02 62.89,64.47 75.59,64.47 78.84,61.21 87.27,61.21 88.34,60.15 DRIVER1.15
SENSE3  (via drill 0.51)
  Top 0.254: v35.76,60.76 41.96,66.95 SENSE2.P$1
  Bottom 0.254: v35.76,60.76 35.1,60.1 14.63,60.1 DRIVER2.1
SENSE4  (via drill 0.51)
  Top 0.254: v37.13,77.88 41.96,73.05 R1.P$1
  Bottom 0.254: v37.13,77.88 14.63,77.88 DRIVER2.15
V+MTR1  (via drill 0.51)
  Top 0.305: v67.82,63.5 69.24,64.92 U$14.A 69.39,65.02 69.39,67.97 U$13.C 69.44,68.12 70.31,68.99 70.31,71.73 v70.76,72.19 | v51.77,63.5 49.78,63.5 49.78,63.7 MTRCONN.P8 | v81.53,74.37 85.24,78.08 85.24,79.3 90.78,79.3 93.42,76.66 DRIVER1.2
  Bottom 0.305: v51.77,63.5 v67.82,63.5 | v81.53,74.37 79.35,72.19 v70.76,72.19
V+MTR2  (via drill 0.51)
  Top 0.305: v77.62,63.8 76.5,64.92 U$10.A 76.4,65.02 76.4,67.97 U$9.C 76.3,67.51 v75.08,67.51 | v58.78,67.51 58.78,66.75 49.78,66.75 MTRCONN.P6
  Bottom 0.305: v77.62,63.8 78.74,62.69 88.34,62.69 DRIVER1.13 | v75.08,67.51 v58.78,67.51
V+MTR3  (via drill 0.51)
  Top 0.305: v32.72,69.29 31.5,68.07 U$7.C 31.39,67.97 31.39,65.02 U$8.A 31.55,64.97 v32.61,63.91 | v47.7,69.29 49.73,69.29 49.73,69.75 MTRCONN.P4
  Bottom 0.305: v47.7,69.29 v32.72,69.29 | v32.61,63.91 36.73,63.91 36.73,60.35 35.1,58.73 12.19,58.73 9.55,61.37 DRIVER2.2
V+MTR4  (via drill 0.51)
  Top 0.305: U$4.A 23.42,65.02 23.42,67.97 U$3.C 23.27,68.07 16,75.34 14.63,75.34 DRIVER2.13 | v43.59,72.8 49.73,72.8 MTRCONN.P2
  Bottom 0.305: v43.59,72.8 41.05,75.34 14.63,75.34 DRIVER2.13
V-MTR1  (via drill 0.51)
  Top 0.305: U$12.A 69.39,71.02 69.39,73.97 U$11.C 69.55,73.97 v71.22,73.97 | v47.8,67.51 47.8,65.28 49.73,65.28 MTRCONN.P7
  Bottom 0.305: DRIVER1.3 88.34,75.34 72.59,75.34 v71.22,73.97 71.12,73.86 54.15,73.86 v47.8,67.51
V-MTR2  (via drill 0.51)
  Top 0.305: FLYBACK1.C 76.4,73.97 76.4,71.02 U$1.A 76.4,70.87 78.08,69.19 78.08,64.72 78.59,64.21 v78.59,60.3 | v59.74,62.53 59.74,68.48 58.37,68.48 58.17,68.28 49.78,68.28 MTRCONN.P5
  Bottom 0.305: DRIVER1.14 93.42,61.37 90.78,58.73 80.16,58.73 v78.59,60.3 78.49,60.4 61.87,60.4 v59.74,62.53
V-MTR3  (via drill 0.51)
  Top 0.305: U$6.A 31.39,71.02 31.39,73.97 U$5.C | v26.87,66.45 31.29,70.87 U$6.A | v36.52,71.27 49.73,71.27 MTRCONN.P3 | v32.66,71.27 31.5,71.27 U$6.A
  Bottom 0.305: v26.87,66.45 23.06,62.64 14.63,62.64 DRIVER2.3 | v32.66,71.27 v36.52,71.27
V-MTR4
  Top 0.305: U$2.A 23.42,71.02 23.42,73.97 FLYBACK2.C | FLYBACK2.C 23.27,74.07 18.03,79.3 9.55,79.3 9.55,76.66 DRIVER2.14 | MTRCONN.P1 49.73,74.27 45.16,78.84 23.47,78.84 23.47,74.12 FLYBACK2.C

### Text on the board
tDocu: MTRV+ | GND | 7-12V | GND | NanoLab | Water Runner V1